# EAGLE design hvreg_feedback_2PS_FS (EAGLE 7.2.0)
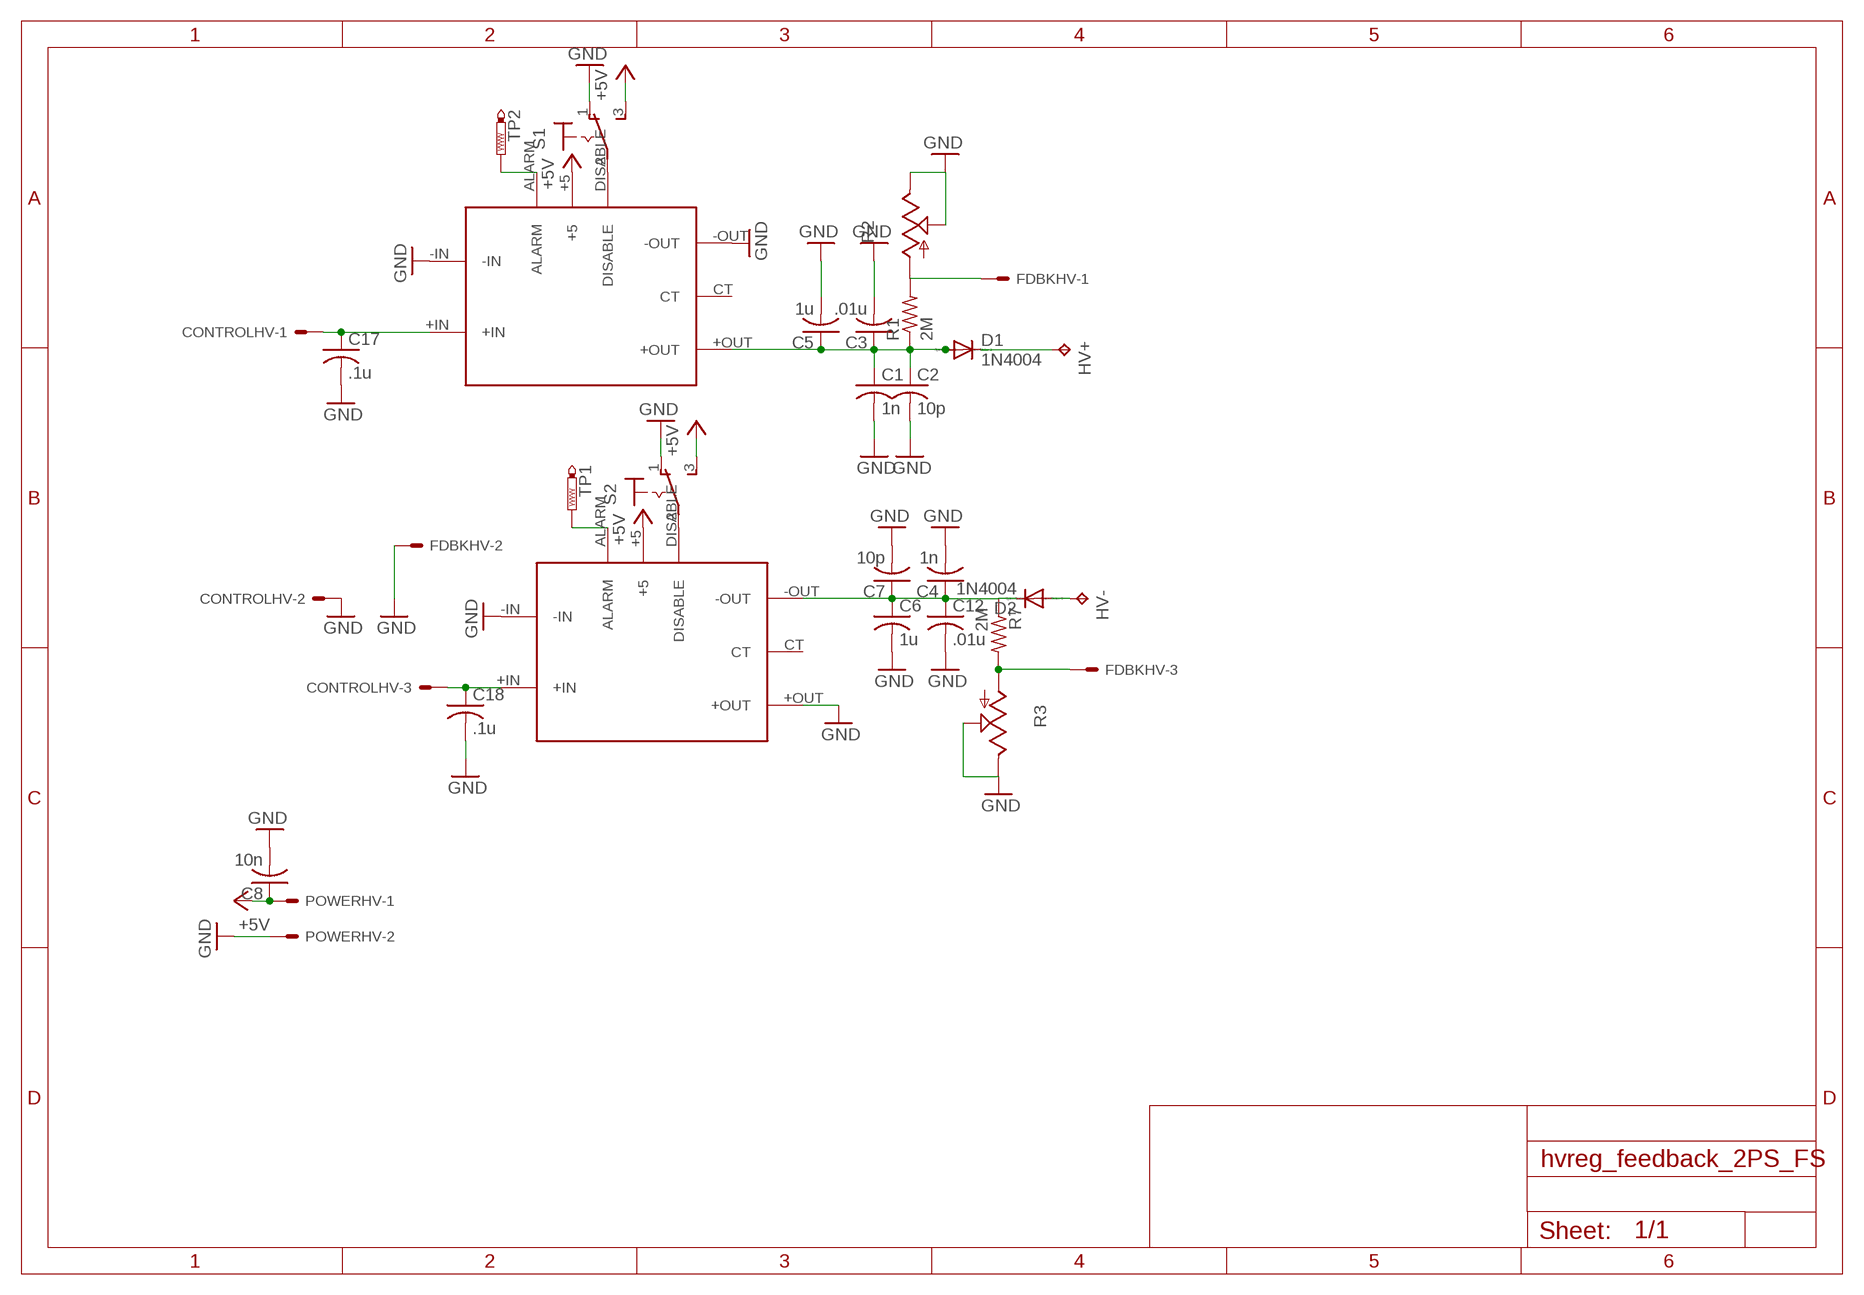
[diagram p0: schematic, sheet 1]

## Parts
C1  1n  C-US102-043X133  [C102-043X133]
C2  10p  C-US102-043X133  [C102-043X133]
C3  .01u  C-US102-043X133  [C102-043X133]
C4  1n  C-US102-043X133  [C102-043X133]
C5  1u  C-US275-205X316  [C275-205X316]
C6  1u  C-US275-205X316  [C275-205X316]
C7  10p  C-US102-043X133  [C102-043X133]
C8  10n  C-US050-024X044  [C050-024X044]
C12  .01u  C-US102-043X133  [C102-043X133]
C17  .1u  C-US225-113X268  [C225-113X268]
C18  .1u  C-US225-113X268  [C225-113X268]
CONTROLHV  KK-156-3  [KK-156-3]
D1  1N4004  [DO41-10]
D2  1N4004  [DO41-10]
FDBKHV  KK-156-3  [KK-156-3]
HV+  TPPAD1-20Y  [P1-20Y]
HV-  TPPAD1-20Y  [P1-20Y]
POWERHV  KK-156-2  [KK-156-2]
R1  2M  R-US_0613/15  [P0613/15]
R2  TRIM_US-B90P  [SP19L]
R3  TRIM_US-B90P  [SP19L]
R7  2M  R-US_0613/15  [P0613/15]
S1  M9040P  [M9040P]
S2  M9040P  [M9040P]
TP1  PTR1PAD1-20Y  [P1-20Y]
TP2  PTR1PAD1-20Y  [P1-20Y]
U$1  EMCO-FS10  [EMCO-FS]
U$2  EMCO-FS10  [EMCO-FS]

## Nets
+5V: C8.1 POWERHV.1 S1.3(S) S2.3(S) U$1.+5 U$2.+5
GND: C1.2 C2.2 C3.2 C4.2 C5.2 C6.2 C7.2 C8.2 C12.2 C17.2 C18.2 CONTROLHV.2 FDBKHV.2 POWERHV.2 R2.E R2.S R3.E R3.S S1.1(O) S2.1(O) U$1.-IN U$1.-OUT U$2.+OUT U$2.-IN
N$1: C1.1 C2.1 C3.1 C5.1 D1.A R1.1 U$1.+OUT
N$2: C4.1 C6.1 C7.1 C12.1 D2.C R7.1 U$2.-OUT
N$3: FDBKHV.1 R1.2 R2.A
N$4: D2.A HV-.TP
N$5: S1.2(P) U$1.DISABLE
N$6: D1.C HV+.TP
N$7: S2.2(P) U$2.DISABLE
N$8: FDBKHV.3 R3.A R7.2
N$9: TP1.TP U$2.ALARM
N$10: TP2.TP U$1.ALARM
N$13: C17.1 CONTROLHV.1 U$1.+IN
N$15: C18.1 CONTROLHV.3 U$2.+IN
Unconnected: U$1.CT U$2.CT

## Library data of the parts
C1-C8 C12 C17 C18 = rcl:C-US: CAPACITOR, American symbol
CONTROLHV FDBKHV = con-molex:KK-156-3: KK 156 HEADER Source: http://www.molex.com/pdm_docs/sd/026604100_sd.pdf; OC_FARNELL: unknown; OC_NEWARK: unknown
D1 D2 = diode:1N4004: DIODE general purpose rectifier, 1 A
HV+ HV- = testpad:TP: Test pad
POWERHV = con-molex:KK-156-2: KK 156 HEADER Source: http://www.molex.com/pdm_docs/sd/026604100_sd.pdf; OC_FARNELL: unknown; OC_NEWARK: unknown
R1 R7 = resistor:R-US_: RESISTOR, American symbol
R2 R3 = pot:TRIM_US-: POTENTIOMETER
S1 S2 = switch:M9040P: TOGGLE SWITCH Marquardt
TP1 TP2 = testpad:PTR1: TEST PIN
U$1 U$2 = dc-dc-converter:EMCO-FS10

## Board
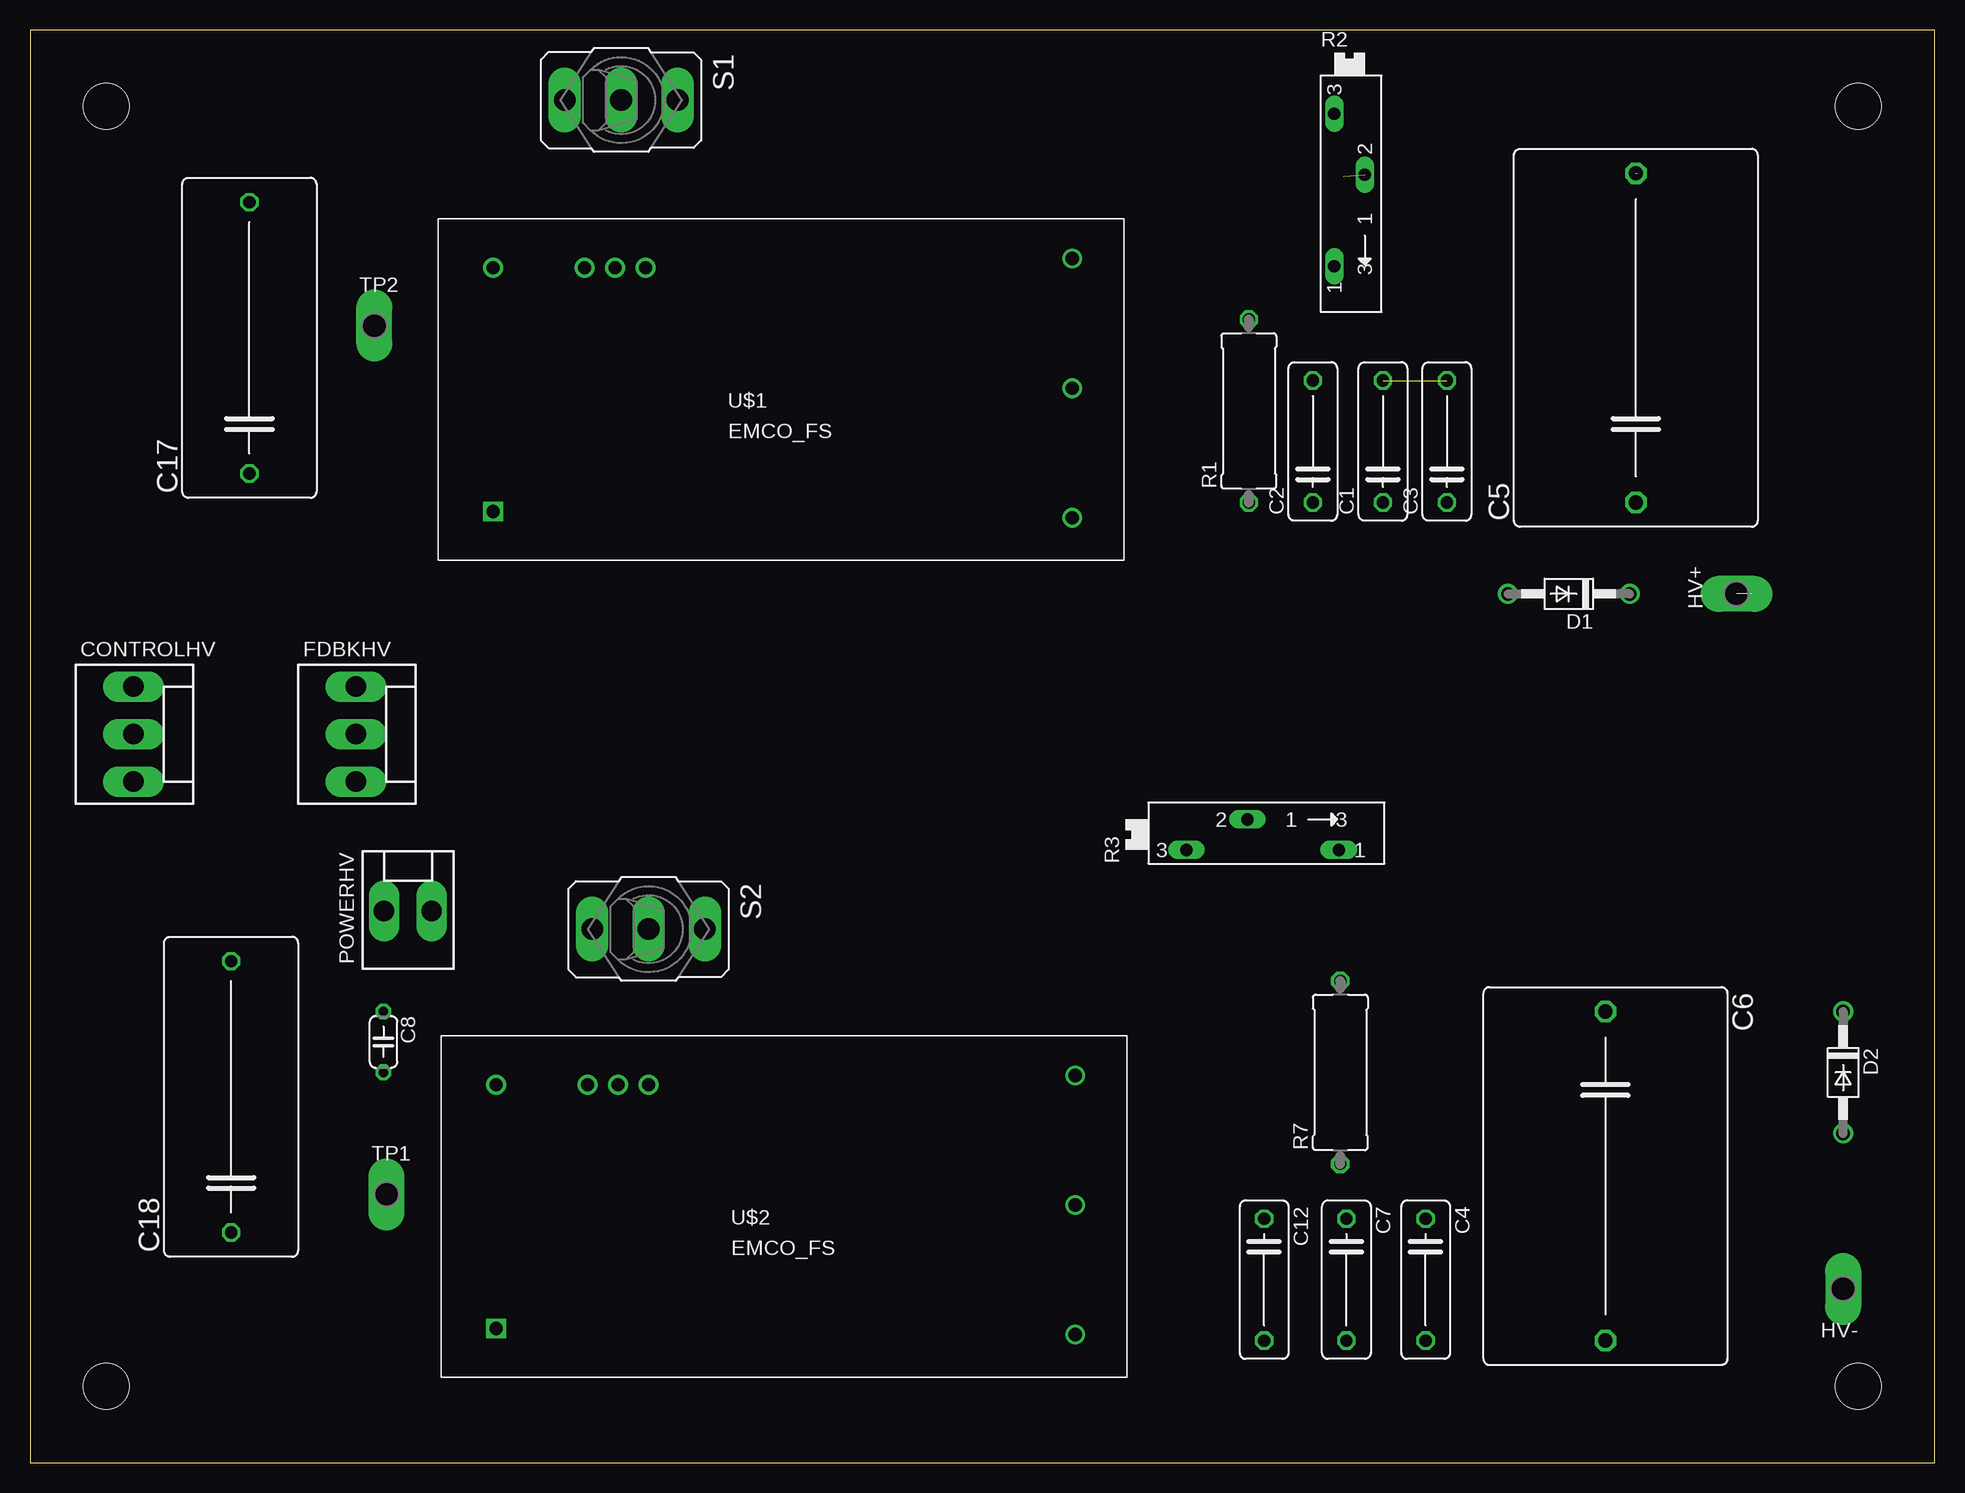
[diagram p1: board, top side]
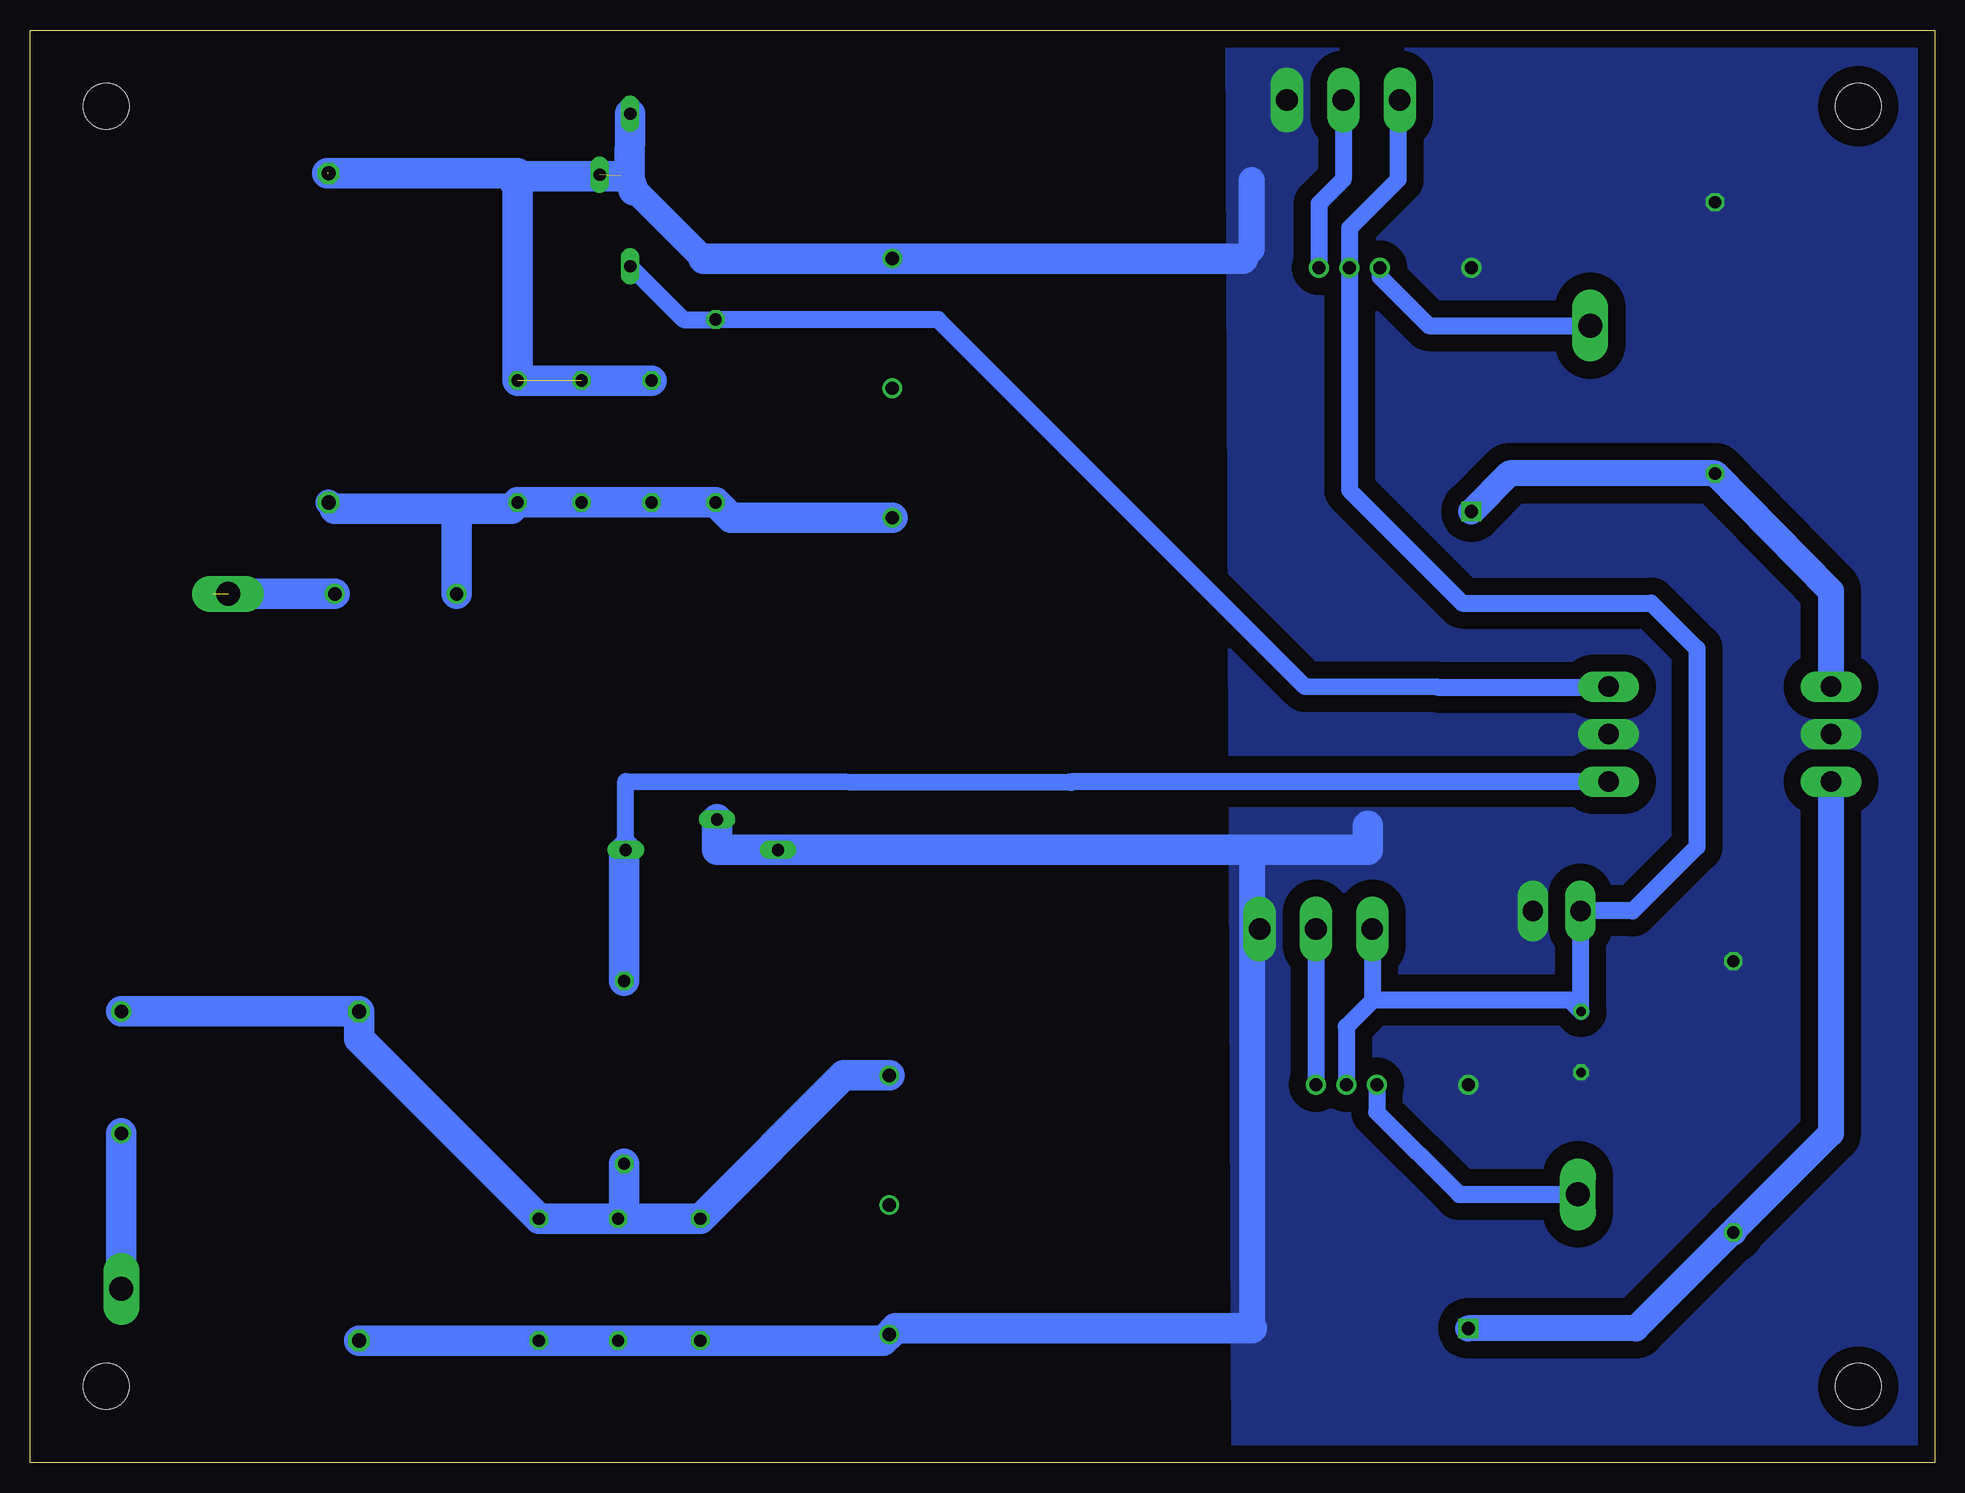
[diagram p2: board, bottom side, seen from below]

Size 158.75 x 119.38 mm. Coordinates in mm from the lower left corner, seen from the top.
Outline: 0,0 158.75,0 158.75,119.38 0,119.38 0,0
Copper layers (1*16): Top 0.035mm / dielectric 1.5mm / Bottom 0.035mm
Design rules "default": minimum track width 10mil, minimum drill 24mil, track to track 8mil, track to pad 8mil, pad to pad 8mil, via to via 8mil, smd to smd 8mil, copper to edge 40mil, drill to drill 8mil, minimum pad ring 10mil, minimum via ring 8mil, stop-mask expansion 4mil, vias tented up to drill 0mil, thermal gap 10mil
Holes 3.8 mm at 152.4,6.35 152.4,113.03 6.35,6.35 6.35,113.03

### Footprints (pad centres in the part's own frame; a part is rotated, then mirrored left to right if it is on the bottom)
C102-043X133 = drill 1.016 octagon: 1 -5.08,0; 2 5.08,0
C275-205X316 = drill 1.194 octagon: 1 -13.716,0; 2 13.716,0
C050-024X044 = drill 0.813 octagon: 1 -2.54,0; 2 2.54,0
C225-113X268 = drill 1.016 octagon: 1 -11.303,0; 2 11.303,0
KK-156-3 = drill 1.7 pad 2.184 long: 1 -3.96,0; 2 0,0; 3 3.96,0
DO41-10 = drill 1.118: A 5.08,0; C -5.08,0
P1-20Y = drill 2.007 pad 2.54 long: TP 0,0
KK-156-2 = drill 1.7 pad 2.184 long: 1 -1.98,0; 2 1.98,0
P0613/15 = drill 1.016 octagon: 1 -7.62,0; 2 7.62,0
SP19L = drill 1.016 long: A 5.715,-1.27; E -6.985,-1.27; S -1.905,1.27
M9040P = drill 1.803 long: 1 0,4.699; 2 0,0; 3 0,-4.699
EMCO-FS = drill 1.1: +5 14.732,24.384; +OUT 52.832,3.556; -IN 4.572,24.384; -OUT 52.832,25.146; ALARM 12.192,24.384; CT 52.832,14.351; DISABLE 17.272,24.384 | drill 1.1 square: +IN 4.572,4.064

### Placement (x,y rotation side)
C1  112.78,85.09 90 top
C2  106.93,85.09 90 top
C3  118.11,85.09 90 top
C4  116.33,15.24 270 top
C5  133.86,93.73 90 top
C6  131.32,23.88 270 top
C7  109.73,15.24 270 top
C8  29.46,35.05 270 top
C12  102.87,15.24 270 top
C17  18.29,93.73 90 top
C18  16.76,30.48 90 top
CONTROLHV  8.64,60.71 270 top
D1  128.27,72.39 180 top
D2  151.13,32.51 270 top
FDBKHV  27.18,60.71 270 top
HV+  142.24,72.39 90 top
HV-  151.13,14.48 180 top
POWERHV  31.5,45.97 0 top
R1  101.6,87.63 90 top
R2  109.98,105.41 270 top
R3  103.38,52.32 0 top
R7  109.22,32.51 90 top
S1  49.28,113.54 270 top
S2  51.56,44.45 270 top
TP1  29.72,22.35 0 top
TP2  28.7,94.74 0 top
U$1  34.04,75.18 0 top
U$2  34.29,7.11 0 top

### Tracks (layer width: path | path; a pad name or v marks a point on that pad's centre or on a via)
+5V
  Bottom 1.422: 48.72,99.62 U$1.+5 | U$1.+5 48.77,102.87 44.7,106.93 44.7,113.41 S1.3 | U$1.+5 48.77,81.03 39.37,71.63 23.62,71.63 19.81,67.82 19.81,51.31 25.15,45.97 POWERHV.1 29.52,37.64 C8.1 30.43,38.56 46.79,38.56 46.86,38.48 | 46.86,38.48 49.02,36.32 U$2.+5 | S2.3 46.86,38.48
GND  (3 unrouted)
  Bottom 2.184: 57.66,100.33 56.9,101.09 56.9,106.88 | 102.62,100.33 109.47,107.19 | 87.63,10.16 U$2.+OUT | 101.47,51.05 57.15,51.05 56.9,50.8 56.9,11.18
  Bottom 2.54: 118.11,106.93 C3.2 C2.2 | 133.98,107.44 118.11,107.44 118.11,107.19 | 108.46,106.05 108.76,106.95 | 108.76,106.95 R2.E | 118.11,107.19 118.11,106.93 | 118.11,106.93 118.36,106.68 118.36,106.93 118.11,107.19 | 118.11,107.19 109.47,107.19 109.29,107.19 108.76,106.95 | C6.2 C4.2 C7.2 C12.2 87.63,10.16 | R3.S 101.47,51.05 R3.E 47.24,51.05 47.24,53.09 | 57.66,100.33 U$1.-OUT 102.62,100.33 | 56.9,11.18 86.61,11.18 U$2.+OUT
  pour Bottom (isolate 1.422, no thermals): 0,119.38 58.93,119.13 58.42,0.25 0.25,0
N$1
  Bottom 2.184: 118.62,79.5 C3.1 | 133.35,79.5 C5.1
  Bottom 2.54: D1.A 123.19,79.5 | U$1.+OUT 100.33,78.74 R1.1 C2.1 C1.1 C3.1 | 123.19,79.5 118.62,79.5 | 123.19,79.5 133.35,79.5
N$2
  Bottom 2.54: D2.C C6.1 131.32,35.31 C4.1 C7.1 109.22,20.32 | 109.22,20.32 C12.1 90.93,32.26 U$2.-OUT | R7.1 109.22,20.32
N$3
  Bottom 1.422: R2.A 104.27,95.25 R1.2 83.06,95.25 52.47,64.67 41.5,64.61 27.23,64.61 FDBKHV.1
N$4
  Bottom 2.54: HV-.TP D2.A
N$5
  Bottom 1.422: S1.2 49.28,106.93 51.31,104.9 U$1.DISABLE
N$6  (1 unrouted)
  Bottom 2.54: D1.C 143.51,72.39
N$7
  Bottom 1.422: S2.2 U$2.DISABLE
N$8
  Bottom 1.422: R3.A 109.09,56.77 72.14,56.7 | 72.14,56.7 71.83,56.69 | FDBKHV.3 71.83,56.75 72.14,56.7
  Bottom 2.54: R7.2 109.22,50.93 R3.A
N$9
  Bottom 1.422: U$2.ALARM 46.48,29.21 39.62,22.35 TP1.TP
N$10
  Bottom 1.422: U$1.ALARM 46.23,98.81 42.16,94.74 TP2.TP
N$13
  Bottom 2.184: CONTROLHV.1 8.64,72.64 C17.1 35.43,82.42 U$1.+IN
N$15
  Bottom 2.184: CONTROLHV.3 8.64,27.43 16.76,19.3 C18.1 16.89,19.18 24.89,11.18 U$2.+IN